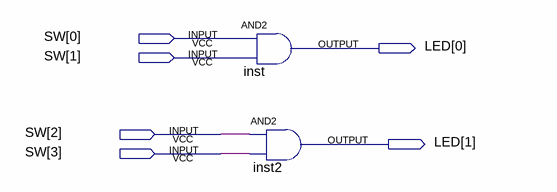
[diagram p0: schematic sheet]
// Quartus schematic exemplo01.bdf as structural Verilog: 2 symbols, 6 pins
module exemplo01 (
  input  [3:0] SW,
  output [1:0] LED
);

  and inst (LED[0], SW[0], SW[1]);
  and inst2 (LED[1], SW[2], SW[3]);
endmodule
